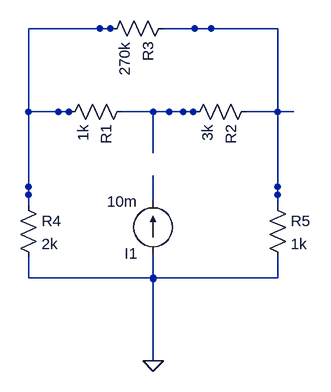
[diagram p0: schematic pannel1_solution.asc]
pannel1_solution.asc, the LTspice schematic file:
Version 4
SHEET 1 880 680
WIRE 464 320 537 320
WIRE 366 320 382 320
SYMBOL res 480 304 R90
SYMATTR InstName R1
SYMATTR Value 1k
WIRE 656 320 729 320
WIRE 558 320 574 320
SYMBOL res 672 304 R90
SYMATTR InstName R2
SYMATTR Value 3k
WIRE 320 464 320 436
WIRE 320 576 320 544
SYMBOL res 304 448 R0
SYMATTR InstName R4
SYMATTR Value 2k
WIRE 704 464 704 436
WIRE 704 576 704 544
SYMBOL res 688 448 R0
SYMATTR InstName R5
SYMATTR Value 1k
WIRE 528 192 601 192
WIRE 430 192 446 192
SYMBOL res 544 176 R90
SYMATTR InstName R3
SYMATTR Value 270k
WIRE 512 538 512 578
WIRE 512 418 512 458
SYMBOL current 512 538 R180
SYMATTR InstName I1
SYMATTR Value 10m
FLAG 512 704 0
WIRE 320 320 320 384
WIRE 320 256 320 320
WIRE 320 320 384 320
WIRE 512 320 512 384
WIRE 512 320 576 320
WIRE 704 320 704 384
WIRE 704 256 704 320
WIRE 448 576 512 576
WIRE 512 576 512 640
WIRE 512 576 576 576
WIRE 320 192 320 256
WIRE 320 192 384 192
WIRE 640 192 704 192
WIRE 704 192 704 256
WIRE 320 576 384 576
WIRE 640 576 704 576
WIRE 384 576 448 576
WIRE 576 576 640 576
WIRE 320 384 320 448
WIRE 512 640 512 704
WIRE 704 384 704 448
WIRE 384 192 448 192
WIRE 576 192 640 192

The netlist it stands for:
* pannel1_solution.asc
R1 N001 N002 1k
R2 N003 N001 3k
R4 N002 0 2k
R5 N003 0 1k
R3 N003 N002 270k
I1 0 N004 10m
.backanno
.end